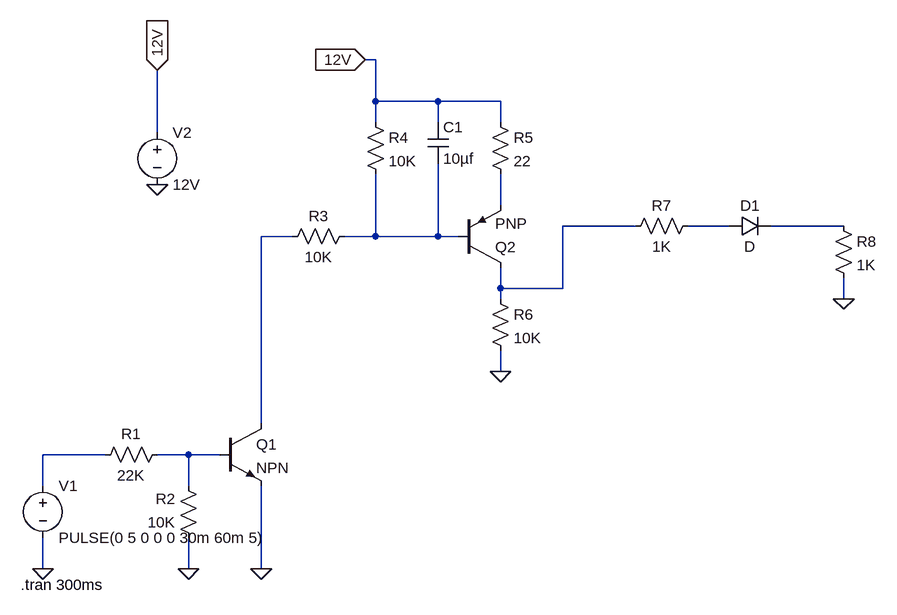
[diagram p0: schematic Gate_1.asc]
Gate_1.asc, the LTspice schematic file:
Version 4
SHEET 1 1188 680
WIRE 384 -448 368 -448
WIRE 384 -384 384 -448
WIRE 480 -384 384 -384
WIRE 576 -384 480 -384
WIRE 384 -352 384 -384
WIRE 480 -352 480 -384
WIRE 576 -352 576 -384
WIRE 48 -336 48 -432
WIRE 576 -224 576 -272
WIRE 784 -192 672 -192
WIRE 928 -192 864 -192
WIRE 1104 -192 992 -192
WIRE 256 -176 208 -176
WIRE 384 -176 384 -272
WIRE 384 -176 336 -176
WIRE 480 -176 480 -288
WIRE 480 -176 384 -176
WIRE 512 -176 480 -176
WIRE 576 -96 576 -128
WIRE 672 -96 672 -192
WIRE 672 -96 576 -96
WIRE 576 -80 576 -96
WIRE 1104 -80 1104 -112
WIRE 576 32 576 0
WIRE 208 112 208 -176
WIRE -32 160 -128 160
WIRE 96 160 48 160
WIRE 144 160 96 160
WIRE -128 208 -128 160
WIRE 96 208 96 160
WIRE -128 336 -128 288
WIRE 96 336 96 288
WIRE 208 336 208 208
FLAG 208 336 0
FLAG 96 336 0
FLAG -128 336 0
FLAG 576 32 0
FLAG 48 -256 0
FLAG 48 -432 12V
IOPIN 48 -432 In
FLAG 368 -448 12V
IOPIN 368 -448 In
FLAG 1104 -80 0
SYMBOL npn 144 112 R0
SYMATTR InstName Q1
SYMBOL res 64 144 R90
WINDOW 0 0 56 VBottom 2
WINDOW 3 32 56 VTop 2
SYMATTR InstName R1
SYMATTR Value 22K
SYMBOL res 112 304 R180
WINDOW 0 36 76 Left 2
WINDOW 3 36 40 Left 2
SYMATTR InstName R2
SYMATTR Value 10K
SYMBOL voltage -128 192 R0
WINDOW 123 0 0 Left 0
WINDOW 39 0 0 Left 0
SYMATTR InstName V1
SYMATTR Value PULSE(0 5 0 0 0 30m 60m 5)
SYMBOL res 352 -192 R90
WINDOW 0 0 56 VBottom 2
WINDOW 3 32 56 VTop 2
SYMATTR InstName R3
SYMATTR Value 10K
SYMBOL res 368 -368 R0
SYMATTR InstName R4
SYMATTR Value 10K
SYMBOL res 560 -368 R0
SYMATTR InstName R5
SYMATTR Value 22
SYMBOL res 560 -96 R0
SYMATTR InstName R6
SYMATTR Value 10K
SYMBOL pnp 512 -128 M180
SYMATTR InstName Q2
SYMBOL cap 464 -352 R0
SYMATTR InstName C1
SYMATTR Value 10µf
SYMATTR SpiceLine V=16V
SYMBOL voltage 48 -352 R0
WINDOW 123 0 0 Left 0
WINDOW 39 0 0 Left 0
SYMATTR InstName V2
SYMATTR Value 12V
SYMBOL res 880 -208 R90
WINDOW 0 0 56 VBottom 2
WINDOW 3 32 56 VTop 2
SYMATTR InstName R7
SYMATTR Value 1K
SYMBOL diode 928 -176 R270
WINDOW 0 32 32 VTop 2
WINDOW 3 0 32 VBottom 2
SYMATTR InstName D1
SYMBOL res 1088 -208 R0
SYMATTR InstName R8
SYMATTR Value 1K
TEXT -162 360 Left 2 !.tran 300ms

The netlist it stands for:
* Gate_1.asc
Q1 N005 N008 0 0 NPN
R1 N008 N007 22K
R2 0 N008 10K
V1 N007 0 PULSE(0 5 0 0 0 30m 60m 5)
R3 N006 N005 10K
R4 12V N006 10K
R5 12V N001 22
R6 N002 0 10K
Q2 N002 N006 N001 0 PNP
C1 12V N006 10µf V=16V
V2 12V 0 12V
R7 N003 N002 1K
D1 N003 N004 D
R8 N004 0 1K
.model D D
.lib standard.dio
.model NPN NPN
.model PNP PNP
.lib standard.bjt
.tran 300ms
.backanno
.end